# Altium schematic sheet Repeat_MOSFET_IRF540.SchDoc: Repeat High Power MOSFET
size A4; Author: Milomir Spajić; Organization: Memristor-Robotics; Address1: Vladimira Perića Valtera; Address2: Novi Sad, 21000; Address3: Serbia
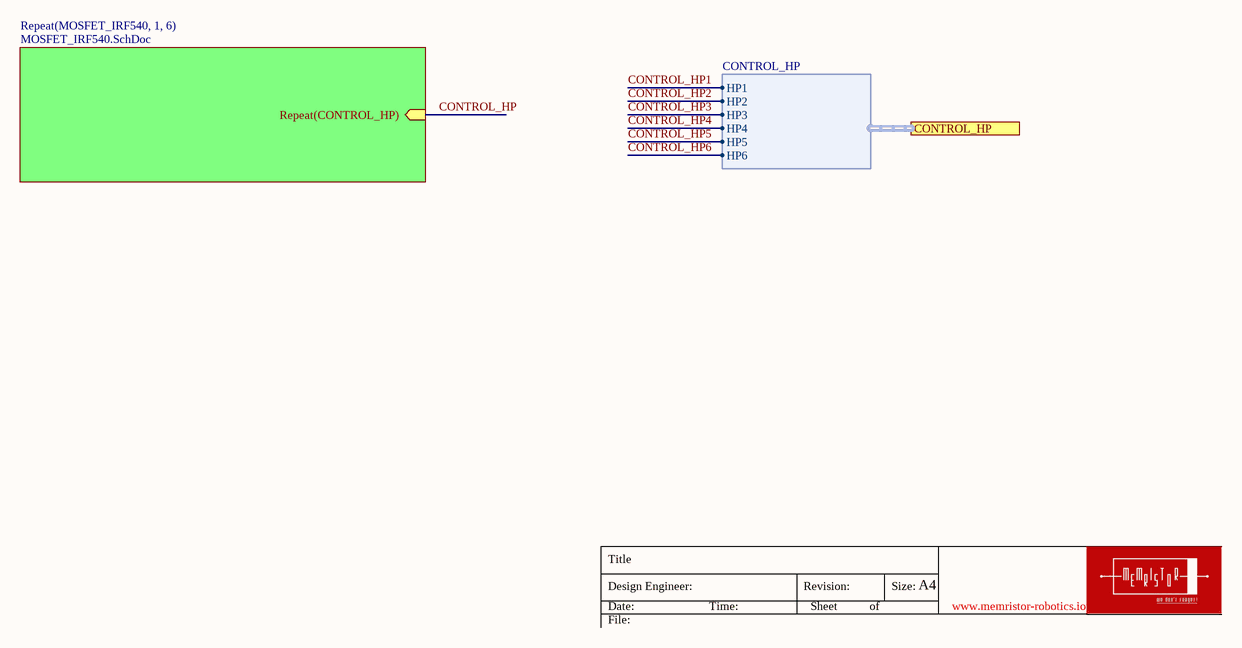
[diagram p0: Repeat_MOSFET_IRF540.SchDoc]

## Sub-sheets
Repeat(MOSFET_IRF540, 1, 6) = MOSFET_IRF540.SchDoc: Repeat(CONTROL_HP) (in)

## Ports
CONTROL_HP (harness CONTROL_HP)

## Harnesses
CONTROL_HP: HP1, HP2, HP3, HP4, HP5, HP6

## Nets
CONTROL_HP: sheet Repeat(MOSFET_IRF540, 1, 6)/Repeat(CONTROL_HP)
CONTROL_HP1: port CONTROL_HP.HP1
CONTROL_HP2: port CONTROL_HP.HP2
CONTROL_HP3: port CONTROL_HP.HP3
CONTROL_HP4: port CONTROL_HP.HP4
CONTROL_HP5: port CONTROL_HP.HP5
CONTROL_HP6: port CONTROL_HP.HP6

## Notes on the sheet
- Title
- Date:
- Design Engineer:
- Time:
- Revision:
- Sheet
- of
- Size:
- A4
- www.memristor-robotics.io
- File: